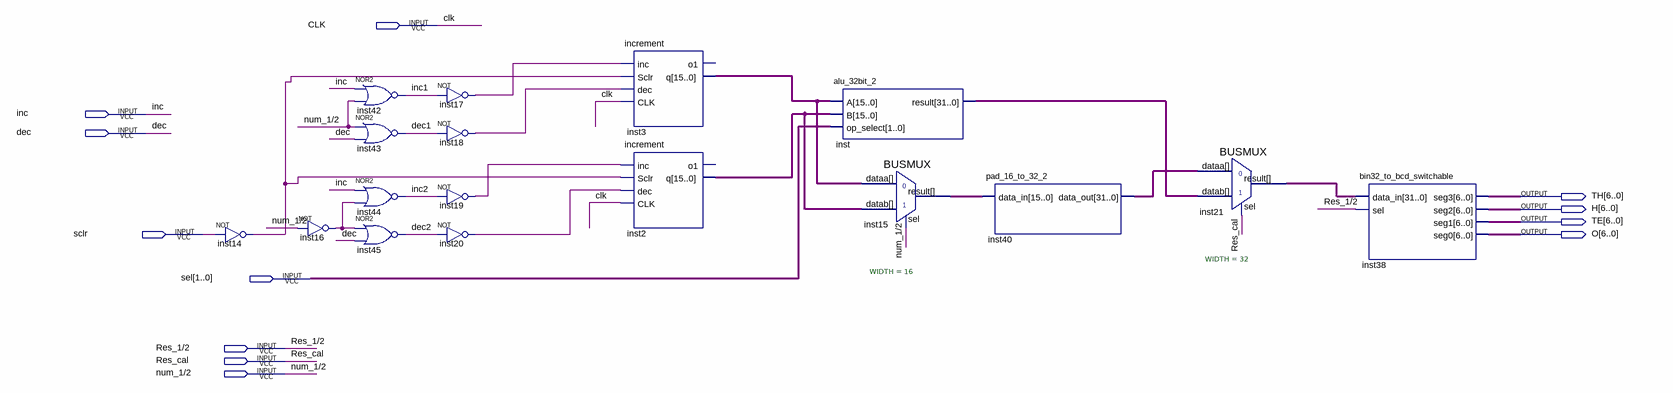
[diagram p0: schematic sheet]
// Quartus schematic final_main.bdf as structural Verilog: 17 symbols, 12 pins
module final_main (
  input  CLK,
  input  inc,
  input  dec,
  input  sclr,
  input  [1:0] sel,
  input  \Res_1/2 ,
  input  Res_cal,
  input  \num_1/2 ,
  output [6:0] TH,
  output [6:0] H,
  output [6:0] TE,
  output [6:0] O
);

  wire dec1, dec2, inc1, inc2, inst14_out, inst16_out, inst17_out, inst18_out, inst19_out, inst20_out;
  wire [15:0] inst2_q, inst3_q, inst15_result;
  wire [31:0] inst21_result, inst40_data_out, inst_result;

  not inst14 (inst14_out, sclr);
  not inst16 (inst16_out, \num_1/2 );
  nor inst42 (inc1, inc, \num_1/2 );
  nor inst43 (dec1, \num_1/2 , dec);
  nor inst44 (inc2, inc, inst16_out);
  nor inst45 (dec2, inst16_out, dec);
  not inst17 (inst17_out, inc1);
  not inst18 (inst18_out, dec1);
  not inst19 (inst19_out, inc2);
  not inst20 (inst20_out, dec2);
  increment inst3 (.inc(inst17_out), .Sclr(inst14_out), .dec(inst18_out), .CLK(CLK), .q(inst3_q));  // open: o1
  increment inst2 (.inc(inst19_out), .Sclr(inst14_out), .dec(inst20_out), .CLK(CLK), .q(inst2_q));  // open: o1
  alu_32bit_2 inst (.A(inst3_q), .B(inst2_q), .op_select(sel), .result(inst_result));
  BUSMUX #(.WIDTH(16)) inst15 (.datab(inst2_q), .sel(\num_1/2 ), .dataa(inst3_q), .result(inst15_result));
  pad_16_to_32_2 inst40 (.data_in(inst15_result), .data_out(inst40_data_out));
  BUSMUX #(.WIDTH(32)) inst21 (.datab(inst_result), .sel(Res_cal), .dataa(inst40_data_out), .result(inst21_result));
  bin32_to_bcd_switchable inst38 (.data_in(inst21_result), .sel(\Res_1/2 ), .seg3(TH), .seg2(H), .seg1(TE), .seg0(O));
endmodule
